# Altium schematic sheet S7CAS-PLEIADES-CARTE-MERE_P02_CONNECTORS.SchDoc
size Tabloid; DocumentNumber: 4; SheetNumber: 4; SheetTotal: 14; Size: 11x17; Sheet_Name: Connecteur FMC
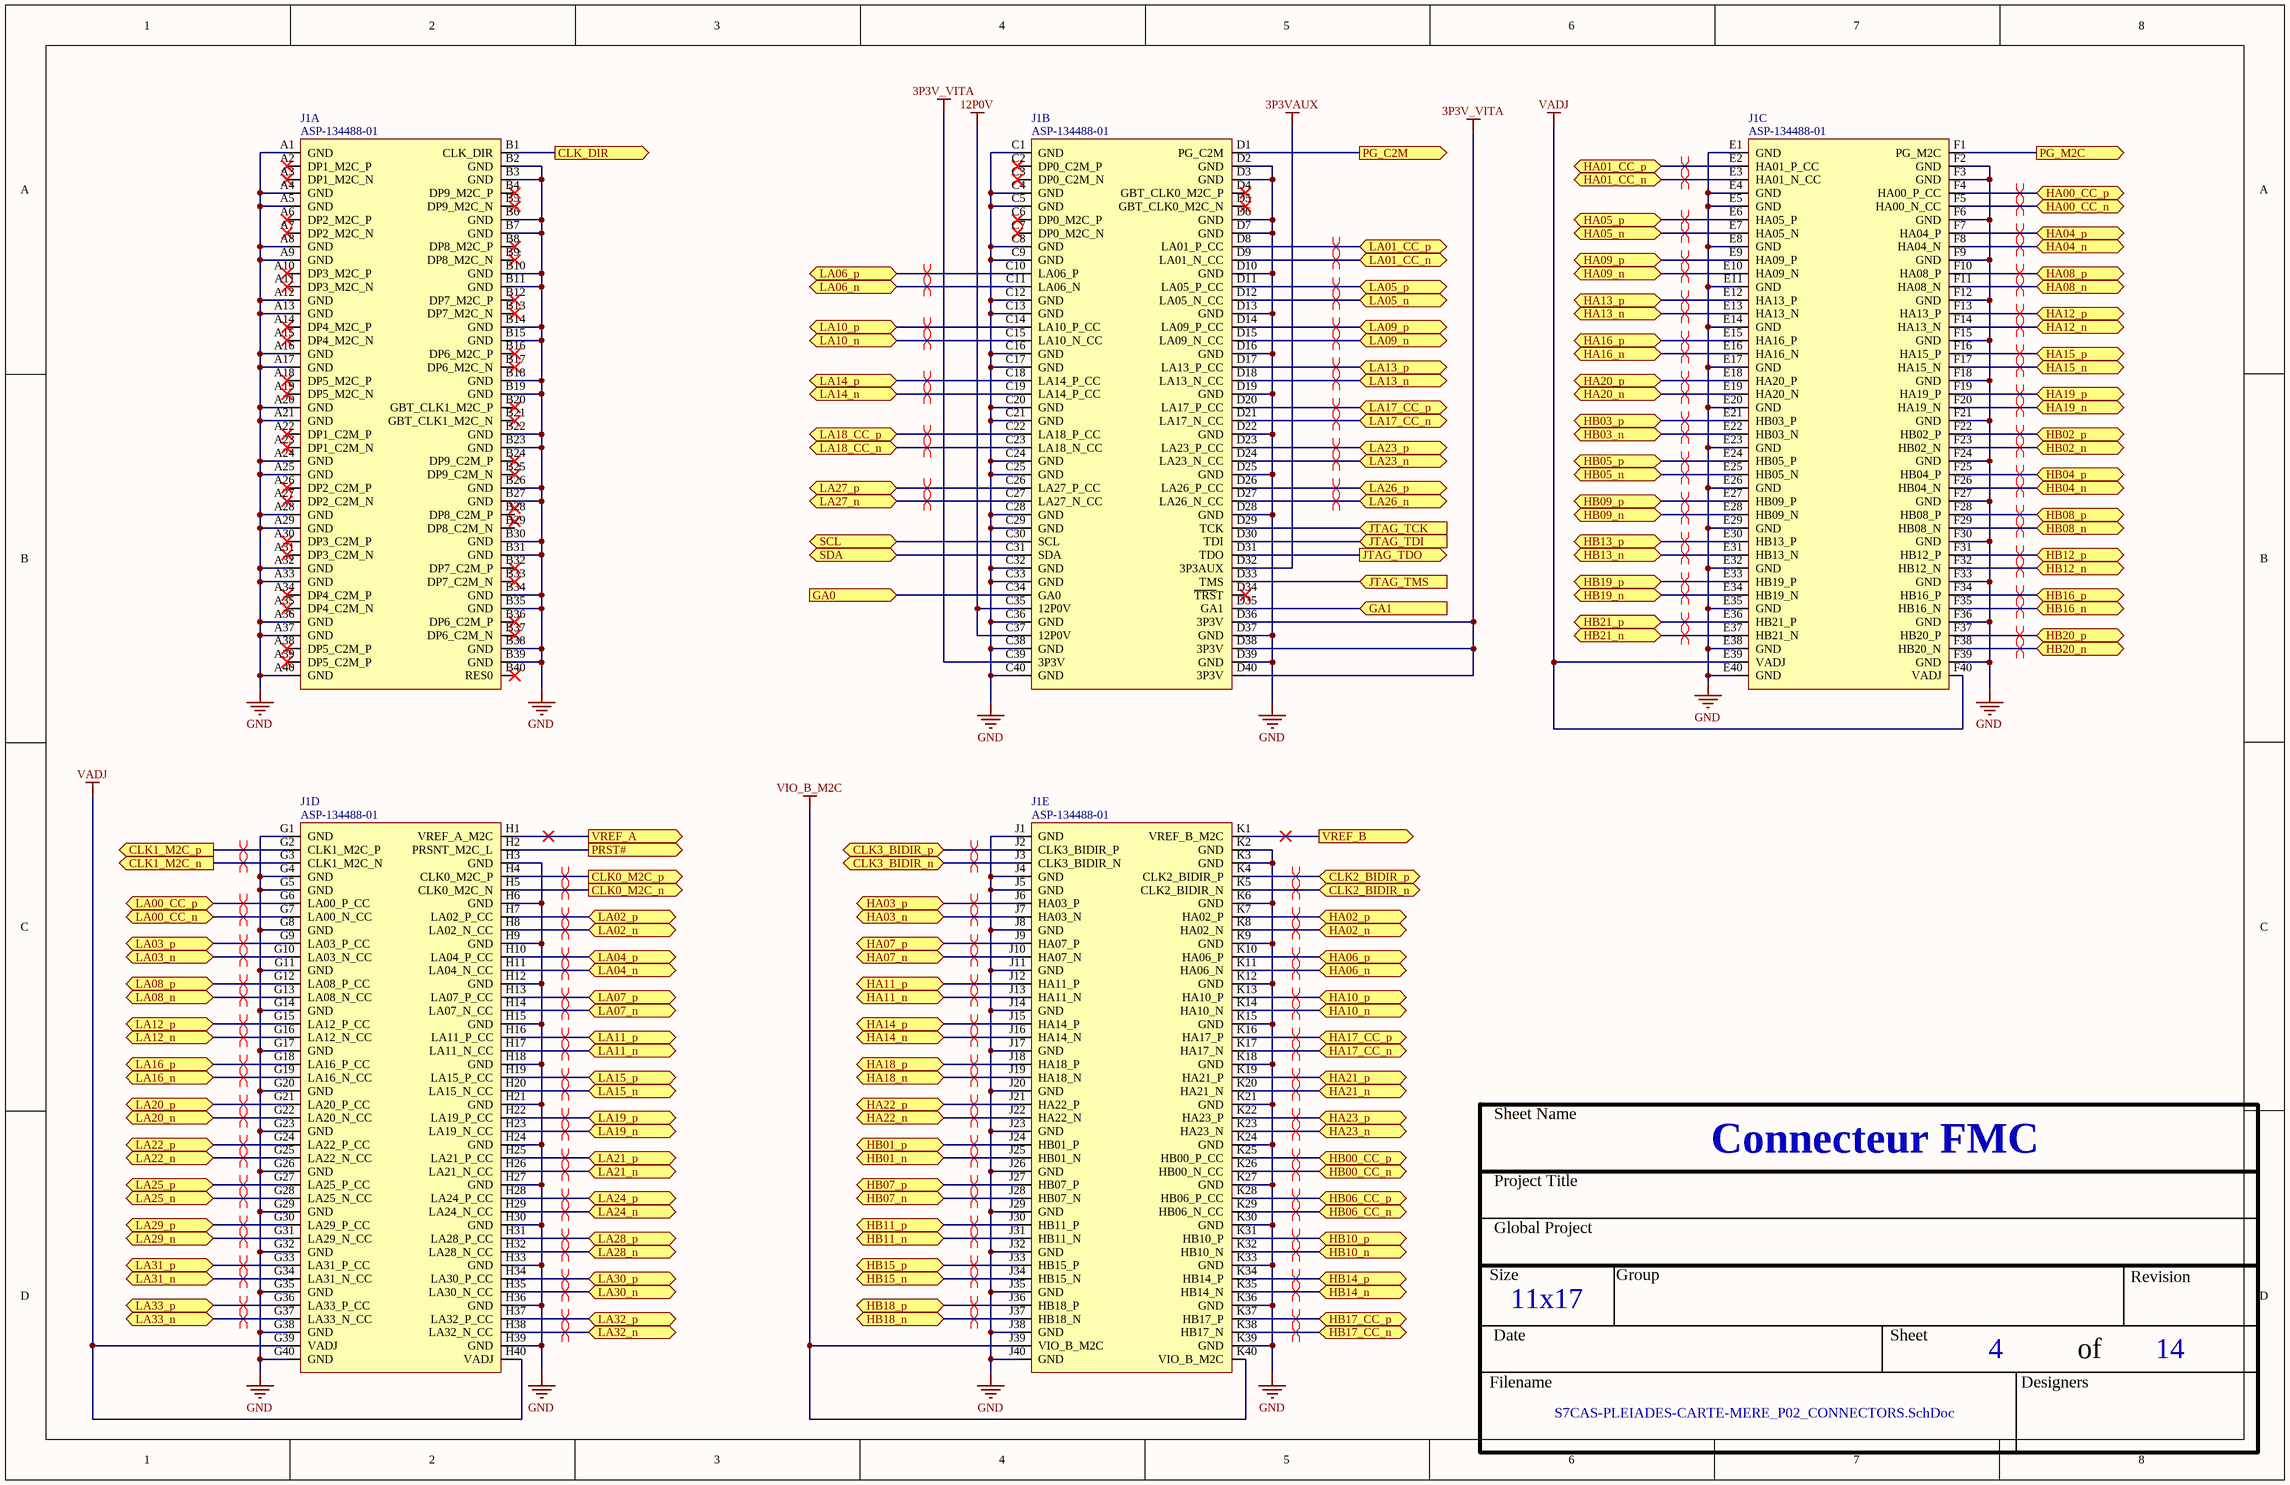
[diagram p0: S7CAS-PLEIADES-CARTE-MERE_P02_CONNECTORS.SchDoc]

## Parts
J1  ASP-134488-01  [CONN_SAMTEC_ASP-134488-01]  (parts A,B,C,D,E of 5)

## Ports
CLK0_M2C_n (out), CLK0_M2C_p (out), CLK1_M2C_n (out), CLK1_M2C_p (out), CLK2_BIDIR_n (bidir), CLK2_BIDIR_p (bidir), CLK3_BIDIR_n (bidir), CLK3_BIDIR_p (bidir), CLK_DIR (out), GA0 (in), GA1 (in), HA00_CC_n (bidir), HA00_CC_p (bidir), HA01_CC_n (bidir), HA01_CC_p (bidir), HA02_n (bidir), HA02_p (bidir), HA03_n (bidir), HA03_p (bidir), HA04_n (bidir), HA04_p (bidir), HA05_n (bidir), HA05_p (bidir), HA06_n (bidir), HA06_p (bidir), HA07_n (bidir), HA07_p (bidir), HA08_n (bidir), HA08_p (bidir), HA09_n (bidir), HA09_p (bidir), HA10_n (bidir), HA10_p (bidir), HA11_n (bidir), HA11_p (bidir), HA12_n (bidir), HA12_p (bidir), HA13_n (bidir), HA13_p (bidir), HA14_n (bidir), HA14_p (bidir), HA15_n (bidir), HA15_p (bidir), HA16_n (bidir), HA16_p (bidir), HA17_CC_n (bidir), HA17_CC_p (bidir), HA18_n (bidir), HA18_p (bidir), HA19_n (bidir), HA19_p (bidir), HA20_n (bidir), HA20_p (bidir), HA21_n (bidir), HA21_p (bidir), HA22_n (bidir), HA22_p (bidir), HA23_n (bidir), HA23_p (bidir), HB00_CC_n (bidir), HB00_CC_p (bidir), HB01_n (bidir), HB01_p (bidir), HB02_n (bidir), HB02_p (bidir), HB03_n (bidir), HB03_p (bidir), HB04_n (bidir), HB04_p (bidir), HB05_n (bidir), HB05_p (bidir), HB06_CC_n (bidir), HB06_CC_p (bidir), HB07_n (bidir), HB07_p (bidir), HB08_n (bidir), HB08_p (bidir), HB09_n (bidir), HB09_p (bidir), HB10_n (bidir), HB10_p (bidir), HB11_n (bidir), HB11_p (bidir), HB12_n (bidir), HB12_p (bidir), HB13_n (bidir), HB13_p (bidir), HB14_n (bidir), HB14_p (bidir), HB15_n (bidir), HB15_p (bidir), HB16_n (bidir), HB16_p (bidir), HB17_CC_n (bidir), HB17_CC_p (bidir), HB18_n (bidir), HB18_p (bidir), HB19_n (bidir), HB19_p (bidir), HB20_n (bidir), HB20_p (bidir), HB21_n (bidir), HB21_p (bidir), JTAG_TCK (in), JTAG_TDI (in), JTAG_TDO (out), JTAG_TMS (in), LA00_CC_n (bidir), LA00_CC_p (bidir), LA01_CC_n (bidir), LA01_CC_p (bidir), LA02_n (bidir), LA02_p (bidir), LA03_n (bidir), LA03_p (bidir), LA04_n (bidir), LA04_p (bidir), LA05_n (bidir), LA05_p (bidir), LA06_n (bidir), LA06_p (bidir), LA07_n (bidir), LA07_p (bidir), LA08_n (bidir), LA08_p (bidir), LA09_n (bidir), LA09_p (bidir), LA10_n (bidir), LA10_p (bidir), LA11_n (bidir), LA11_p (bidir), LA12_n (bidir), LA12_p (bidir), LA13_n (bidir), LA13_p (bidir), LA14_n (bidir), LA14_p (bidir), LA15_n (bidir), LA15_p (bidir), LA16_n (bidir), LA16_p (bidir), LA17_CC_n (bidir), LA17_CC_p (bidir), LA18_CC_n (bidir), LA18_CC_p (bidir), LA19_n (bidir), LA19_p (bidir), LA20_n (bidir), LA20_p (bidir), LA21_n (bidir), LA21_p (bidir), LA22_n (bidir), LA22_p (bidir), LA23_n (bidir), LA23_p (bidir), LA24_n (bidir), LA24_p (bidir), LA25_n (bidir), LA25_p (bidir), LA26_n (bidir), LA26_p (bidir), LA27_n (bidir), LA27_p (bidir), LA28_n (bidir), LA28_p (bidir), LA29_n (bidir), LA29_p (bidir), LA30_n (bidir), LA30_p (bidir), LA31_n (bidir), LA31_p (bidir), LA32_n (bidir), LA32_p (bidir), LA33_n (bidir), LA33_p (bidir), PG_C2M (out), PG_M2C (out), PRST# (out), SCL (bidir), SDA (bidir), VREF_A (out), VREF_B (out)

## Nets
3P3V_VITA: J1.C39(3P3V) J1.D36(3P3V) J1.D38(3P3V) J1.D40(3P3V)
3P3VAUX: J1.D32(3P3AUX)
12P0V: J1.C35(12P0V) J1.C37(12P0V)
GND: J1.A1(GND) J1.A4(GND) J1.A5(GND) J1.A8(GND) J1.A9(GND) J1.A12(GND) J1.A13(GND) J1.A16(GND) J1.A17(GND) J1.A20(GND) J1.A21(GND) J1.A24(GND) J1.A25(GND) J1.A28(GND) J1.A29(GND) J1.A32(GND) J1.A33(GND) J1.A36(GND) J1.A37(GND) J1.A40(GND) J1.B2(GND) J1.B3(GND) J1.B6(GND) J1.B7(GND) J1.B10(GND) J1.B11(GND) J1.B14(GND) J1.B15(GND) J1.B18(GND) J1.B19(GND) J1.B22(GND) J1.B23(GND) J1.B26(GND) J1.B27(GND) J1.B30(GND) J1.B31(GND) J1.B34(GND) J1.B35(GND) J1.B38(GND) J1.B39(GND) J1.C1(GND) J1.C4(GND) J1.C5(GND) J1.C8(GND) J1.C9(GND) J1.C12(GND) J1.C13(GND) J1.C16(GND) J1.C17(GND) J1.C20(GND) J1.C21(GND) J1.C24(GND) J1.C25(GND) J1.C28(GND) J1.C29(GND) J1.C32(GND) J1.C33(GND) J1.C36(GND) J1.C38(GND) J1.C40(GND) J1.D2(GND) J1.D3(GND) J1.D6(GND) J1.D7(GND) J1.D10(GND) J1.D13(GND) J1.D16(GND) J1.D19(GND) J1.D22(GND) J1.D25(GND) J1.D28(GND) J1.D37(GND) J1.D39(GND) J1.E1(GND) J1.E4(GND) J1.E5(GND) J1.E8(GND) J1.E11(GND) J1.E14(GND) J1.E17(GND) J1.E20(GND) J1.E23(GND) J1.E26(GND) J1.E29(GND) J1.E32(GND) J1.E35(GND) J1.E38(GND) J1.E40(GND) J1.F2(GND) J1.F3(GND) J1.F6(GND) J1.F9(GND) J1.F12(GND) J1.F15(GND) J1.F18(GND) J1.F21(GND) J1.F24(GND) J1.F27(GND) J1.F30(GND) J1.F33(GND) J1.F36(GND) J1.F39(GND) J1.G1(GND) J1.G4(GND) J1.G5(GND) J1.G8(GND) J1.G11(GND) J1.G14(GND) J1.G17(GND) J1.G20(GND) J1.G23(GND) J1.G26(GND) J1.G29(GND) J1.G32(GND) J1.G35(GND) J1.G38(GND) J1.G40(GND) J1.H3(GND) J1.H6(GND) J1.H9(GND) J1.H12(GND) J1.H15(GND) J1.H18(GND) J1.H21(GND) J1.H24(GND) J1.H27(GND) J1.H30(GND) J1.H33(GND) J1.H36(GND) J1.H39(GND) J1.J1(GND) J1.J4(GND) J1.J5(GND) J1.J8(GND) J1.J11(GND) J1.J14(GND) J1.J17(GND) J1.J20(GND) J1.J23(GND) J1.J26(GND) J1.J29(GND) J1.J32(GND) J1.J35(GND) J1.J38(GND) J1.J40(GND) J1.K2(GND) J1.K3(GND) J1.K6(GND) J1.K9(GND) J1.K12(GND) J1.K15(GND) J1.K18(GND) J1.K21(GND) J1.K24(GND) J1.K27(GND) J1.K30(GND) J1.K33(GND) J1.K36(GND) J1.K39(GND)
VADJ: J1.E39(VADJ) J1.F40(VADJ) J1.G39(VADJ) J1.H40(VADJ)
VIO_B_M2C: J1.J39(VIO_B_M2C) J1.K40(VIO_B_M2C)
CLK0_M2C_n: J1.H5(CLK0_M2C_N) ; port CLK0_M2C_n
CLK0_M2C_p: J1.H4(CLK0_M2C_P) ; port CLK0_M2C_p
CLK1_M2C_n: J1.G3(CLK1_M2C_N) ; port CLK1_M2C_n
CLK1_M2C_p: J1.G2(CLK1_M2C_P) ; port CLK1_M2C_p
CLK2_BIDIR_n: J1.K5(CLK2_BIDIR_N) ; port CLK2_BIDIR_n
CLK2_BIDIR_p: J1.K4(CLK2_BIDIR_P) ; port CLK2_BIDIR_p
CLK3_BIDIR_n: J1.J3(CLK3_BIDIR_N) ; port CLK3_BIDIR_n
CLK3_BIDIR_p: J1.J2(CLK3_BIDIR_P) ; port CLK3_BIDIR_p
CLK_DIR: J1.B1(CLK_DIR) ; port CLK_DIR
GA0: J1.C34(GA0) ; port GA0
GA1: J1.D35(GA1) ; port GA1
HA00_CC_n: J1.F5(HA00_N_CC) ; port HA00_CC_n
HA00_CC_p: J1.F4(HA00_P_CC) ; port HA00_CC_p
HA01_CC_n: J1.E3(HA01_N_CC) ; port HA01_CC_n
HA01_CC_p: J1.E2(HA01_P_CC) ; port HA01_CC_p
HA02_n: J1.K8(HA02_N) ; port HA02_n
HA02_p: J1.K7(HA02_P) ; port HA02_p
HA03_n: J1.J7(HA03_N) ; port HA03_n
HA03_p: J1.J6(HA03_P) ; port HA03_p
HA04_n: J1.F8(HA04_N) ; port HA04_n
HA04_p: J1.F7(HA04_P) ; port HA04_p
HA05_n: J1.E7(HA05_N) ; port HA05_n
HA05_p: J1.E6(HA05_P) ; port HA05_p
HA06_n: J1.K11(HA06_N) ; port HA06_n
HA06_p: J1.K10(HA06_P) ; port HA06_p
HA07_n: J1.J10(HA07_N) ; port HA07_n
HA07_p: J1.J9(HA07_P) ; port HA07_p
HA08_n: J1.F11(HA08_N) ; port HA08_n
HA08_p: J1.F10(HA08_P) ; port HA08_p
HA09_n: J1.E10(HA09_N) ; port HA09_n
HA09_p: J1.E9(HA09_P) ; port HA09_p
HA10_n: J1.K14(HA10_N) ; port HA10_n
HA10_p: J1.K13(HA10_P) ; port HA10_p
HA11_n: J1.J13(HA11_N) ; port HA11_n
HA11_p: J1.J12(HA11_P) ; port HA11_p
HA12_n: J1.F14(HA13_N) ; port HA12_n
HA12_p: J1.F13(HA13_P) ; port HA12_p
HA13_n: J1.E13(HA13_N) ; port HA13_n
HA13_p: J1.E12(HA13_P) ; port HA13_p
HA14_n: J1.J16(HA14_N) ; port HA14_n
HA14_p: J1.J15(HA14_P) ; port HA14_p
HA15_n: J1.F17(HA15_N) ; port HA15_n
HA15_p: J1.F16(HA15_P) ; port HA15_p
HA16_n: J1.E16(HA16_N) ; port HA16_n
HA16_p: J1.E15(HA16_P) ; port HA16_p
HA17_CC_n: J1.K17(HA17_N) ; port HA17_CC_n
HA17_CC_p: J1.K16(HA17_P) ; port HA17_CC_p
HA18_n: J1.J19(HA18_N) ; port HA18_n
HA18_p: J1.J18(HA18_P) ; port HA18_p
HA19_n: J1.F20(HA19_N) ; port HA19_n
HA19_p: J1.F19(HA19_P) ; port HA19_p
HA20_n: J1.E19(HA20_N) ; port HA20_n
HA20_p: J1.E18(HA20_P) ; port HA20_p
HA21_n: J1.K20(HA21_N) ; port HA21_n
HA21_p: J1.K19(HA21_P) ; port HA21_p
HA22_n: J1.J22(HA22_N) ; port HA22_n
HA22_p: J1.J21(HA22_P) ; port HA22_p
HA23_n: J1.K23(HA23_N) ; port HA23_n
HA23_p: J1.K22(HA23_P) ; port HA23_p
HB00_CC_n: J1.K26(HB00_N_CC) ; port HB00_CC_n
HB00_CC_p: J1.K25(HB00_P_CC) ; port HB00_CC_p
HB01_n: J1.J25(HB01_N) ; port HB01_n
HB01_p: J1.J24(HB01_P) ; port HB01_p
HB02_n: J1.F23(HB02_N) ; port HB02_n
HB02_p: J1.F22(HB02_P) ; port HB02_p
HB03_n: J1.E22(HB03_N) ; port HB03_n
HB03_p: J1.E21(HB03_P) ; port HB03_p
HB04_n: J1.F26(HB04_N) ; port HB04_n
HB04_p: J1.F25(HB04_P) ; port HB04_p
HB05_n: J1.E25(HB05_N) ; port HB05_n
HB05_p: J1.E24(HB05_P) ; port HB05_p
HB06_CC_n: J1.K29(HB06_N_CC) ; port HB06_CC_n
HB06_CC_p: J1.K28(HB06_P_CC) ; port HB06_CC_p
HB07_n: J1.J28(HB07_N) ; port HB07_n
HB07_p: J1.J27(HB07_P) ; port HB07_p
HB08_n: J1.F29(HB08_N) ; port HB08_n
HB08_p: J1.F28(HB08_P) ; port HB08_p
HB09_n: J1.E28(HB09_N) ; port HB09_n
HB09_p: J1.E27(HB09_P) ; port HB09_p
HB10_n: J1.K32(HB10_N) ; port HB10_n
HB10_p: J1.K31(HB10_P) ; port HB10_p
HB11_n: J1.J31(HB11_N) ; port HB11_n
HB11_p: J1.J30(HB11_P) ; port HB11_p
HB12_n: J1.F32(HB12_N) ; port HB12_n
HB12_p: J1.F31(HB12_P) ; port HB12_p
HB13_n: J1.E31(HB13_N) ; port HB13_n
HB13_p: J1.E30(HB13_P) ; port HB13_p
HB14_n: J1.K35(HB14_N) ; port HB14_n
HB14_p: J1.K34(HB14_P) ; port HB14_p
HB15_n: J1.J34(HB15_N) ; port HB15_n
HB15_p: J1.J33(HB15_P) ; port HB15_p
HB16_n: J1.F35(HB16_N) ; port HB16_n
HB16_p: J1.F34(HB16_P) ; port HB16_p
HB17_CC_n: J1.K38(HB17_N) ; port HB17_CC_n
HB17_CC_p: J1.K37(HB17_P) ; port HB17_CC_p
HB18_n: J1.J37(HB18_N) ; port HB18_n
HB18_p: J1.J36(HB18_P) ; port HB18_p
HB19_n: J1.E34(HB19_N) ; port HB19_n
HB19_p: J1.E33(HB19_P) ; port HB19_p
HB20_n: J1.F38(HB20_N) ; port HB20_n
HB20_p: J1.F37(HB20_P) ; port HB20_p
HB21_n: J1.E37(HB21_N) ; port HB21_n
HB21_p: J1.E36(HB21_P) ; port HB21_p
JTAG_TCK: J1.D29(TCK) ; port JTAG_TCK
JTAG_TDI: J1.D30(TDI) ; port JTAG_TDI
JTAG_TDO: J1.D31(TDO) ; port JTAG_TDO
JTAG_TMS: J1.D33(TMS) ; port JTAG_TMS
LA00_CC_n: J1.G7(LA00_N_CC) ; port LA00_CC_n
LA00_CC_p: J1.G6(LA00_P_CC) ; port LA00_CC_p
LA01_CC_n: J1.D9(LA01_N_CC) ; port LA01_CC_n
LA01_CC_p: J1.D8(LA01_P_CC) ; port LA01_CC_p
LA02_n: J1.H8(LA02_N_CC) ; port LA02_n
LA02_p: J1.H7(LA02_P_CC) ; port LA02_p
LA03_n: J1.G10(LA03_N_CC) ; port LA03_n
LA03_p: J1.G9(LA03_P_CC) ; port LA03_p
LA04_n: J1.H11(LA04_N_CC) ; port LA04_n
LA04_p: J1.H10(LA04_P_CC) ; port LA04_p
LA05_n: J1.D12(LA05_N_CC) ; port LA05_n
LA05_p: J1.D11(LA05_P_CC) ; port LA05_p
LA06_n: J1.C11(LA06_N) ; port LA06_n
LA06_p: J1.C10(LA06_P) ; port LA06_p
LA07_n: J1.H14(LA07_N_CC) ; port LA07_n
LA07_p: J1.H13(LA07_P_CC) ; port LA07_p
LA08_n: J1.G13(LA08_N_CC) ; port LA08_n
LA08_p: J1.G12(LA08_P_CC) ; port LA08_p
LA09_n: J1.D15(LA09_N_CC) ; port LA09_n
LA09_p: J1.D14(LA09_P_CC) ; port LA09_p
LA10_n: J1.C15(LA10_N_CC) ; port LA10_n
LA10_p: J1.C14(LA10_P_CC) ; port LA10_p
LA11_n: J1.H17(LA11_N_CC) ; port LA11_n
LA11_p: J1.H16(LA11_P_CC) ; port LA11_p
LA12_n: J1.G16(LA12_N_CC) ; port LA12_n
LA12_p: J1.G15(LA12_P_CC) ; port LA12_p
LA13_n: J1.D18(LA13_N_CC) ; port LA13_n
LA13_p: J1.D17(LA13_P_CC) ; port LA13_p
LA14_n: J1.C19(LA14_P_CC) ; port LA14_n
LA14_p: J1.C18(LA14_P_CC) ; port LA14_p
LA15_n: J1.H20(LA15_N_CC) ; port LA15_n
LA15_p: J1.H19(LA15_P_CC) ; port LA15_p
LA16_n: J1.G19(LA16_N_CC) ; port LA16_n
LA16_p: J1.G18(LA16_P_CC) ; port LA16_p
LA17_CC_n: J1.D21(LA17_N_CC) ; port LA17_CC_n
LA17_CC_p: J1.D20(LA17_P_CC) ; port LA17_CC_p
LA18_CC_n: J1.C23(LA18_N_CC) ; port LA18_CC_n
LA18_CC_p: J1.C22(LA18_P_CC) ; port LA18_CC_p
LA19_n: J1.H23(LA19_N_CC) ; port LA19_n
LA19_p: J1.H22(LA19_P_CC) ; port LA19_p
LA20_n: J1.G22(LA20_N_CC) ; port LA20_n
LA20_p: J1.G21(LA20_P_CC) ; port LA20_p
LA21_n: J1.H26(LA21_N_CC) ; port LA21_n
LA21_p: J1.H25(LA21_P_CC) ; port LA21_p
LA22_n: J1.G25(LA22_N_CC) ; port LA22_n
LA22_p: J1.G24(LA22_P_CC) ; port LA22_p
LA23_n: J1.D24(LA23_N_CC) ; port LA23_n
LA23_p: J1.D23(LA23_P_CC) ; port LA23_p
LA24_n: J1.H29(LA24_N_CC) ; port LA24_n
LA24_p: J1.H28(LA24_P_CC) ; port LA24_p
LA25_n: J1.G28(LA25_N_CC) ; port LA25_n
LA25_p: J1.G27(LA25_P_CC) ; port LA25_p
LA26_n: J1.D27(LA26_N_CC) ; port LA26_n
LA26_p: J1.D26(LA26_P_CC) ; port LA26_p
LA27_n: J1.C27(LA27_N_CC) ; port LA27_n
LA27_p: J1.C26(LA27_P_CC) ; port LA27_p
LA28_n: J1.H32(LA28_N_CC) ; port LA28_n
LA28_p: J1.H31(LA28_P_CC) ; port LA28_p
LA29_n: J1.G31(LA29_N_CC) ; port LA29_n
LA29_p: J1.G30(LA29_P_CC) ; port LA29_p
LA30_n: J1.H35(LA30_N_CC) ; port LA30_n
LA30_p: J1.H34(LA30_P_CC) ; port LA30_p
LA31_n: J1.G34(LA31_N_CC) ; port LA31_n
LA31_p: J1.G33(LA31_P_CC) ; port LA31_p
LA32_n: J1.H38(LA32_N_CC) ; port LA32_n
LA32_p: J1.H37(LA32_P_CC) ; port LA32_p
LA33_n: J1.G37(LA33_N_CC) ; port LA33_n
LA33_p: J1.G36(LA33_P_CC) ; port LA33_p
PG_C2M: J1.D1(PG_C2M) ; port PG_C2M
PG_M2C: J1.F1(PG_M2C) ; port PG_M2C
PRST#: J1.H2(PRSNT_M2C_L) ; port PRST#
SCL: J1.C30(SCL) ; port SCL
SDA: J1.C31(SDA) ; port SDA
VREF_A: J1.H1(VREF_A_M2C) ; port VREF_A
VREF_B: J1.K1(VREF_B_M2C) ; port VREF_B

Not connected (* = marked no-connect by the designer): J1 A2(DP1_M2C_P)* A3(DP1_M2C_N)* A6(DP2_M2C_P)* A7(DP2_M2C_N)* A10(DP3_M2C_P)* A11(DP3_M2C_N)* A14(DP4_M2C_P)* A15(DP4_M2C_N)* A18(DP5_M2C_P)* A19(DP5_M2C_N)* A22(DP1_C2M_P)* A23(DP1_C2M_N)* A26(DP2_C2M_P)* A27(DP2_C2M_N)* A30(DP3_C2M_P)* A31(DP3_C2M_N)* A34(DP4_C2M_P)* A35(DP4_C2M_N)* A38(DP5_C2M_P)* A39(DP5_C2M_P)* B4(DP9_M2C_P)* B5(DP9_M2C_N)* B8(DP8_M2C_P)* B9(DP8_M2C_N)* B12(DP7_M2C_P)* B13(DP7_M2C_N)* B16(DP6_M2C_P)* B17(DP6_M2C_N)* B20(GBT_CLK1_M2C_P)* B21(GBT_CLK1_M2C_N)* B24(DP9_C2M_P)* B25(DP9_C2M_N)* B28(DP8_C2M_P) B29(DP8_C2M_N) B32(DP7_C2M_P)* B33(DP7_C2M_N)* B36(DP6_C2M_P)* B37(DP6_C2M_N)* B40(RES0)* C2(DP0_C2M_P)* C3(DP0_C2M_N)* C6(DP0_M2C_P)* C7(DP0_M2C_N)* D4(GBT_CLK0_M2C_P)* D5(GBT_CLK0_M2C_N)* D34(~{TRS}T)*

## Layout directives
differential pair; differential pair class DIFF_PAIR: CLK0_M2C_n, CLK0_M2C_p, CLK1_M2C_n, CLK1_M2C_p, HA00_CC_n, HA00_CC_p, HA01_CC_n, HA01_CC_p, HA02_n, HA02_p, HA03_n, HA03_p, HA04_n, HA04_p, HA05_n, HA05_p, HA06_n, HA06_p, HA07_n, HA07_p, HA08_n, HA08_p, HA09_n, HA09_p, HA10_n, HA10_p, HA11_n, HA11_p, HA12_n, HA12_p, HA13_n, HA13_p, HA14_n, HA14_p, HA15_n, HA15_p, HA16_n, HA16_p, HA17_CC_n, HA17_CC_p, HA18_n, HA18_p, HA19_n, HA19_p, HA20_n, HA20_p, HA21_n, HA21_p, HA22_n, HA22_p, HA23_n, HA23_p, HB00_CC_n, HB00_CC_p, HB01_n, HB01_p, HB02_n, HB02_p, HB03_n, HB03_p, HB04_n, HB04_p, HB05_n, HB05_p, HB06_CC_n, HB06_CC_p, HB07_n, HB07_p, HB08_n, HB08_p, HB09_n, HB09_p, HB10_n, HB10_p, HB11_n, HB11_p, HB12_n, HB12_p, HB13_n, HB13_p, HB14_n, HB14_p, HB15_n, HB15_p, HB16_n, HB16_p, HB17_CC_n, HB17_CC_p, HB18_n, HB18_p, HB19_n, HB19_p, HB20_n, HB20_p, HB21_n, HB21_p, LA00_CC_n, LA00_CC_p, LA01_CC_n, LA01_CC_p, LA02_n, LA02_p, LA03_n, LA03_p, LA04_n, LA04_p, LA05_n, LA05_p, LA06_n, LA06_p, LA07_n, LA07_p, LA08_n, LA08_p, LA09_n, LA09_p, LA10_n, LA10_p, LA11_n, LA11_p, LA12_n, LA12_p, LA13_n, LA13_p, LA14_n, LA14_p, LA15_n, LA15_p, LA16_n, LA16_p, LA17_CC_n, LA17_CC_p, LA18_CC_n, LA18_CC_p, LA19_n, LA19_p, LA20_n, LA20_p, LA21_n, LA21_p, LA22_n, LA22_p, LA23_n, LA23_p, LA24_n, LA24_p, LA25_n, LA25_p, LA26_n, LA26_p, LA27_n, LA27_p, LA28_n, LA28_p, LA29_n, LA29_p, LA30_n, LA30_p, LA31_n, LA31_p, LA32_n, LA32_p, LA33_n, LA33_p
differential pair: CLK2_BIDIR_n, CLK2_BIDIR_p, CLK3_BIDIR_n, CLK3_BIDIR_p

## Notes on the sheet
- Sheet Name
- Project Title
- Global Project
- Size
- Group
- Revision
- Date
- Sheet
- of
- Filename
- Designers

## Library data of the parts
J1 = CONN_SAMTEC_ASP-134488-01: CONN - VITA 57 MEZZ MALE (DAUGHTERBOARD) HIGH DENSITY - SMD-400; Voltage: 240VAC; Current: 1.8A; Mfg: Samtec; Power: *; Mfg Part Number: ASP-134488-01; HelpURL: http://suddendocs.samtec.com/prints/asp-134488-01-mkt.pdf; CreatedBy: Jonathan Bouchard; Temperature: -55 °C to +125 °C; Value: *; Precision: *; Package: SMD-400